# EAGLE design BeagleboneCape-V2 (EAGLE 6.4)
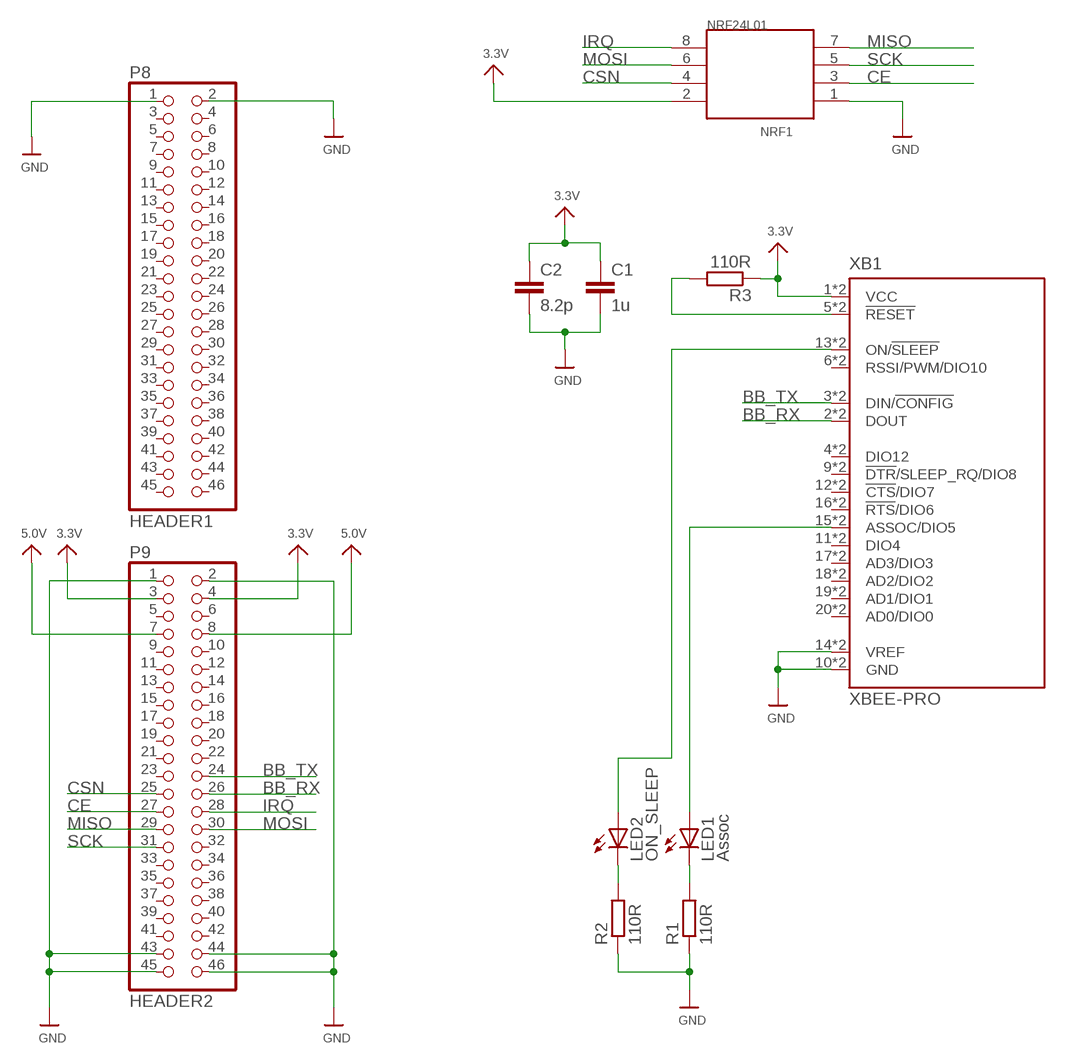
[diagram p0: schematic, sheet 1]

## Parts
C1  1u  C-EUC1206  [C1206]
C2  8.2p  C-EUC1206  [C1206]
LED1  Assoc  LEDSMT1206  [1206]
LED2  ON_SLEEP  LEDSMT1206  [1206]
NRF24L01  NRF1  2X4SMDHEADER  [TSM-110-XX-XXX-DV]
P8  HEADER1  PINHD-2X24  [2X23]
P9  HEADER2  PINHD-2X24  [2X23]
R1  110R  R-EU_R1206  [R1206]
R2  110R  R-EU_R1206  [R1206]
R3  110R  R-EU_R1206  [R1206]
XB1  XBEE-PRO  [XBEE-PRO]

## Nets
3.3V: C1.1 C2.1 NRF24L01.2 P9.3 P9.4 R3.1 XB1.1(VCC) XB1.1-1(VCC)
5.0V: P9.7 P9.8
ASSOC: LED1.A XB1.15(ASSOC/DIO5) XB1.15-1(ASSOC/DIO5)
BB_RX: P9.26 XB1.2(DOUT) XB1.2-1(DOUT)
BB_TX: P9.24 XB1.3(DIN/!CONFIG) XB1.3-1(DIN/!CONFIG)
CE: NRF24L01.3 P9.27
CSN: NRF24L01.4 P9.25
GND: C1.2 C2.2 NRF24L01.1 P8.1 P8.2 P9.1 P9.2 P9.43 P9.44 P9.45 P9.46 R1.1 R2.1 XB1.10(GND) XB1.10-1(GND) XB1.14(VREF) XB1.14-1(VREF)
IRQ: NRF24L01.8 P9.28
MISO: NRF24L01.7 P9.29
MOSI: NRF24L01.6 P9.30
N$1: LED1.C R1.2
N$2: R3.2 XB1.5(!RESET) XB1.5-1(!RESET)
N$3: LED2.C R2.2
ON_SLEEP: LED2.A XB1.13(ON/!SLEEP) XB1.13-1(ON/!SLEEP)
SCK: NRF24L01.5 P9.31
Unconnected: P8.3 P8.4 P8.5 P8.6 P8.7 P8.8 P8.9 P8.10 P8.11 P8.12 P8.13 P8.14 P8.15 P8.16 P8.17 P8.18 P8.19 P8.20 P8.21 P8.22 P8.23 P8.24 P8.25 P8.26 P8.27 P8.28 P8.29 P8.30 P8.31 P8.32 P8.33 P8.34 P8.35 P8.36 P8.37 P8.38 P8.39 P8.40 P8.41 P8.42 P8.43 P8.44 P8.45 P8.46 P9.5 P9.6 P9.9 P9.10 P9.11 P9.12 P9.13 P9.14 P9.15 P9.16 P9.17 P9.18 P9.19 P9.20 P9.21 P9.22 P9.23 P9.32 P9.33 P9.34 P9.35 P9.36 P9.37 P9.38 P9.39 P9.40 P9.41 P9.42 XB1.4(DIO12) XB1.4-1(DIO12) XB1.6(RSSI/PWM/DIO10) XB1.6-1(RSSI/PWM/DIO10) XB1.9(!DTR!/SLEEP_RQ/DIO8) XB1.9-1(!DTR!/SLEEP_RQ/DIO8) XB1.11(DIO4) XB1.11-1(DIO4) XB1.12(!CTS!/DIO7) XB1.12-1(!CTS!/DIO7) XB1.16(!RTS!/DIO6) XB1.16-1(!RTS!/DIO6) XB1.17(AD3/DIO3) XB1.17-1(AD3/DIO3) XB1.18(AD2/DIO2) XB1.18-1(AD2/DIO2) XB1.19(AD1/DIO1) XB1.19-1(AD1/DIO1) XB1.20(AD0/DIO0) XB1.20-1(AD0/DIO0)

## Library data of the parts
C1 C2 = rcl:C-EU: CAPACITOR, European symbol
LED1 LED2 = led:LED: LED OSRAM: - CHIPLED LG R971, LG N971, LY N971, LG Q971, LY Q971, LO R971, LY R971 LH N974, LH R974 LS Q976, LO Q976, LY Q976 LO Q996 - Hyper CHIPLED LW Q18S LB Q993, LB Q99A, LB R99A - SideLED LS A670, LO A670, LY A670, LG A670, LP A670 LB A673, LV A673, LT A673, LW A673 LH A674 LY A675 LS A676, LA A676, LO A676, LY A676, LW A676 LS A679, LY A679, LG A679 - Hyper Micro SIDELED® LS Y876, LA Y876, LO Y876, LY Y876 LT Y87S - SmartLED LW L88C, LW L88S LB L89C, LB L89S, LG L890 LS L89K, LO L89K, LY L89K LS L896, LA L896, LO L896, LY L896 - TOPLED LS T670, LO T670, LY T670, LG T670, LP T670 LSG T670, LSP T670, LSY T670, LOP T670, LYG T670 LG T671, LOG T671, LSG T671 LB T673, LV T673, LT T673, LW T673 LH T674 LS T676, LA T676, LO T676, LY T676, LB T676, LH T676, LSB T676, LW T676 LB T67C, LV T67C, LT T67C, LS T67K, LO T67K, LY T67K, LW E67C LS E67B, LA E67B, LO E67B, LY E67B, LB E67C, LV E67C, LT E67C LW T67C LS T679, LY T679, LG T679 LS T770, LO T770, LY T770, LG T770, LP T770 LB T773, LV T773, LT T773, LW T773 LH T774 LS E675, LA E675, LY E675, LS T675 LS T776, LA T776, LO T776, LY T776, LB T776 LHGB T686 LT T68C, LB T68C - Hyper Mini TOPLED® LB M676 - Mini TOPLED Santana® LG M470 LS M47K, LO M47K, LY M47K Source: http://www.osram.convergy.de LUXEON: - LUMILED® LXK2-PW12-R00, LXK2-PW12-S00, LXK2-PW14-U00, LXK2-PW14-V00 LXK2-PM12-R00, LXK2-PM12-S00, LXK2-PM14-U00 LXK2-PE12-Q00, LXK2-PE12-R00, LXK2-PE12-S00, LXK2-PE14-T00, LXK2-PE14-U00 LXK2-PB12-K00, LXK2-PB12-L00, LXK2-PB12-M00, LXK2-PB14-N00, LXK2-PB14-P00, LXK2-PB14-Q00 LXK2-PR12-L00, LXK2-PR12-M00, LXK2-PR14-Q00, LXK2-PR14-R00 LXK2-PD12-Q00, LXK2-PD12-R00, LXK2-PD12-S00 LXK2-PH12-R00, LXK2-PH12-S00 LXK2-PL12-P00, LXK2-PL12-Q00, LXK2-PL12-R00 Source: www.luxeon.com KINGBRIGHT: KA-3528ASYC Source: www.kingbright.com
NRF24L01 = Header:2X4SMDHEADER
P8 P9 = 2X23Header:PINHD-2X24: PIN HEADER
R1-R3 = rcl:R-EU_: RESISTOR, European symbol
XB1 = xbee:XBEE: XBee (TM) /XBee-PRO(TM) OEM RF Modules Source: MaxStream, Inc. xbee_productmanual.pdf; MPN: XBP24-AWI-001; OC_FARNELL: 1337916; OC_NEWARK: 42M2667

## Board
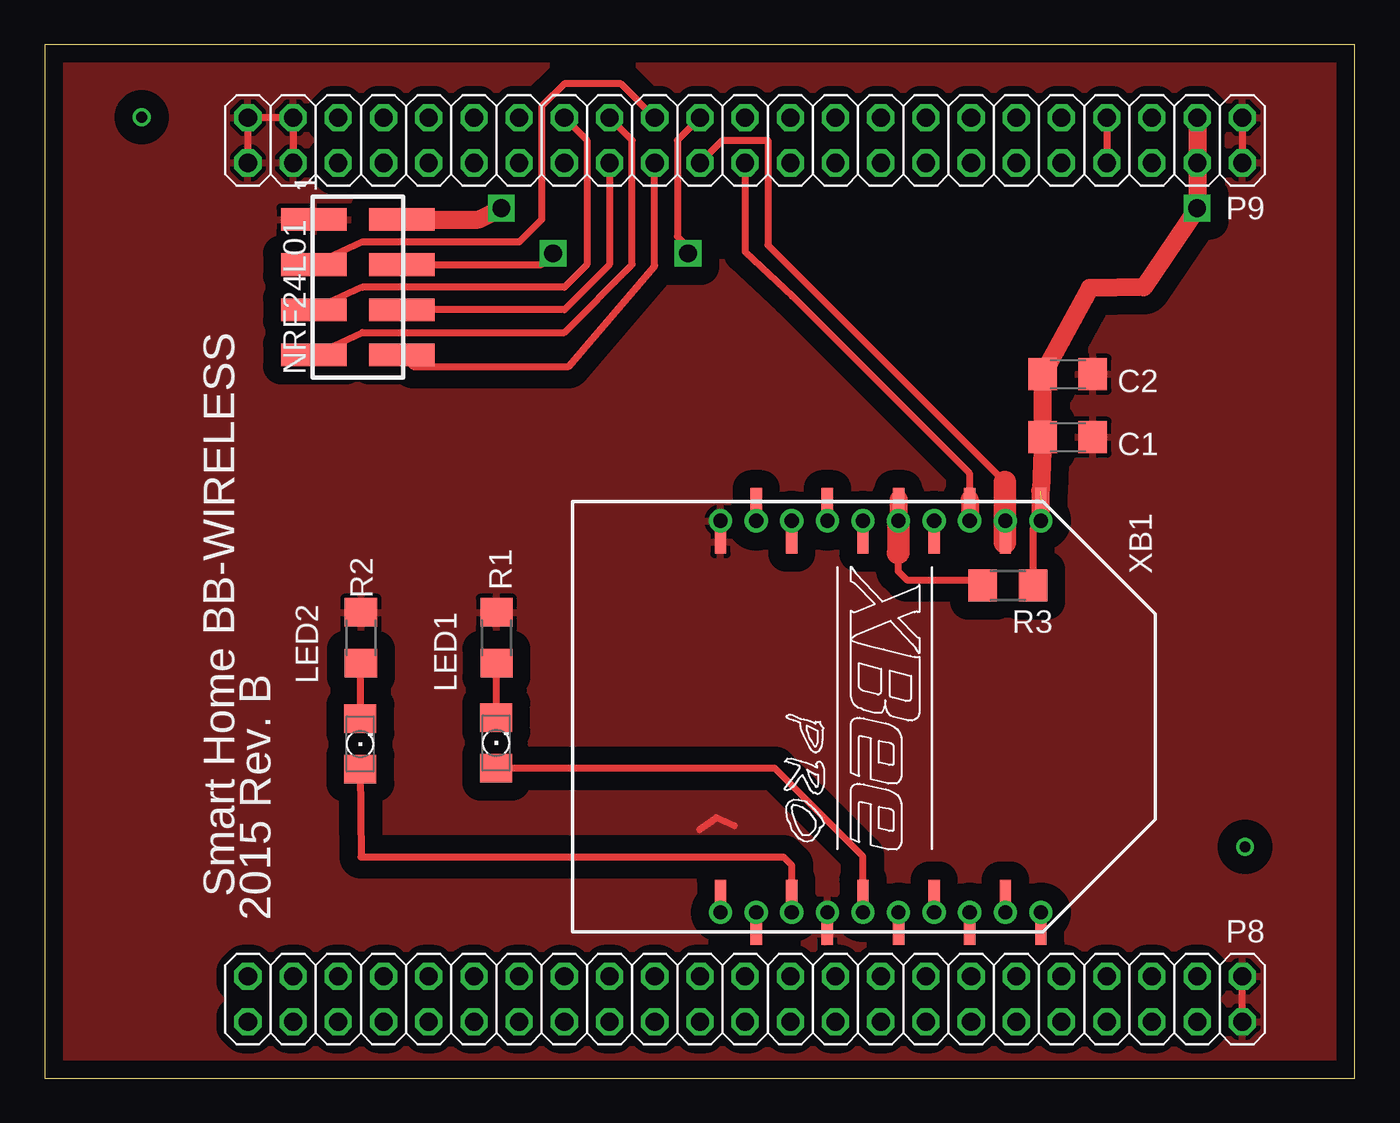
[diagram p1: board, top side]
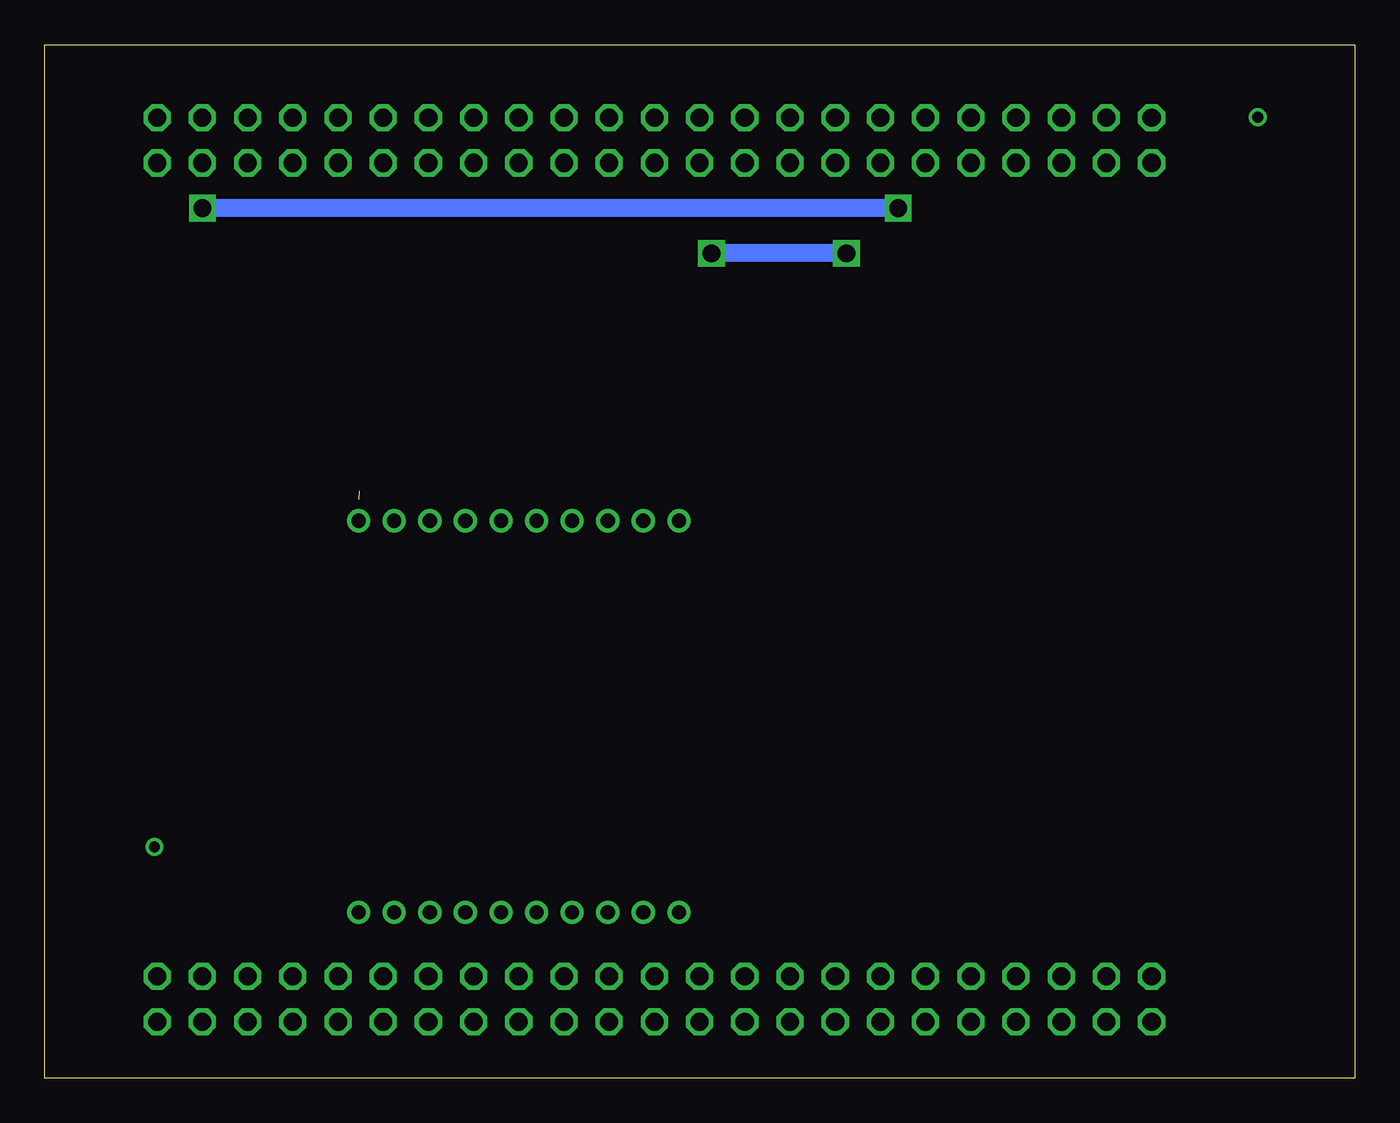
[diagram p2: board, bottom side, seen from below]

Size 73.64 x 58.09 mm. Coordinates in mm from the lower left corner, seen from the top.
Outline: 0,0 73.64,0 73.64,58.09 0,58.09 0,0
Copper layers (1*16): Top 0.035mm / dielectric 1.5mm / Bottom 0.035mm
Design rules "default": minimum track width 10mil, minimum drill 24mil, track to track 8mil, track to pad 8mil, pad to pad 8mil, via to via 8mil, smd to smd 8mil, copper to edge 40mil, drill to drill 8mil, minimum pad ring 10mil, minimum via ring 8mil, stop-mask expansion 4mil, vias tented up to drill 0mil, thermal gap 10mil

### Footprints (pad centres in the part's own frame; a part is rotated, then mirrored left to right if it is on the bottom)
C1206 = smd 1.6 x 1.8: 1 -1.4,0; 2 1.4,0
1206 = smd 1.6 x 1.803: A -1.422,0; C 1.422,0
TSM-110-XX-XXX-DV = smd 1.27 x 3.683: 1 -3.81,-2.731; 2 -3.81,2.223; 3 -1.27,-2.731; 4 -1.27,2.223; 5 1.27,-2.731; 6 1.27,2.223; 7 3.81,-2.731; 8 3.81,2.223
2X23 = drill 1.016 octagon: 1 -27.94,-1.27; 2 -27.94,1.27; 3 -25.4,-1.27; 4 -25.4,1.27; 5 -22.86,-1.27; 6 -22.86,1.27; 7 -20.32,-1.27; 8 -20.32,1.27; 9 -17.78,-1.27; 10 -17.78,1.27; 11 -15.24,-1.27; 12 -15.24,1.27; 13 -12.7,-1.27; 14 -12.7,1.27; 15 -10.16,-1.27; 16 -10.16,1.27; 17 -7.62,-1.27; 18 -7.62,1.27; 19 -5.08,-1.27; 20 -5.08,1.27; 21 -2.54,-1.27; 22 -2.54,1.27; 23 0,-1.27; 24 0,1.27; 25 2.54,-1.27; 26 2.54,1.27; 27 5.08,-1.27; 28 5.08,1.27; 29 7.62,-1.27; 30 7.62,1.27; 31 10.16,-1.27; 32 10.16,1.27; 33 12.7,-1.27; 34 12.7,1.27; 35 15.24,-1.27; 36 15.24,1.27; 37 17.78,-1.27; 38 17.78,1.27; 39 20.32,-1.27; 40 20.32,1.27; 41 22.86,-1.27; 42 22.86,1.27; 43 25.4,-1.27; 44 25.4,1.27; 45 27.94,-1.27; 46 27.94,1.27
R1206 = smd 1.6 x 1.803: 1 -1.422,0; 2 1.422,0
XBEE-PRO = drill 0.8 pad 1.27: 1 -11,9; 2 -11,7; 3 -11,5; 4 -11,3; 5 -11,1; 6 -11,-1; 7 -11,-3; 8 -11,-5; 9 -11,-7; 10 -11,-9; 11 11,-9; 12 11,-7; 13 11,-5; 14 11,-3; 15 11,-1; 16 11,1; 17 11,3; 18 11,5; 19 11,7; 20 11,9 | smd 1.27 x 0.635: 1-1 -12.2,9; 2-1 -9.8,7; 3-1 -12.2,5; 4-1 -9.8,3; 5-1 -12.2,1; 6-1 -9.8,-1; 7-1 -12.2,-3; 8-1 -9.8,-5; 9-1 -12.2,-7; 10-1 -9.8,-9; 11-1 9.8,-9; 12-1 12.2,-7; 13-1 9.8,-5; 14-1 12.2,-3; 15-1 9.8,-1; 16-1 12.2,1; 17-1 9.8,3; 18-1 12.2,5; 19-1 9.8,7; 20-1 12.2,9

### Placement (x,y rotation side)
C1  57.5,36.02 0 top
C2  57.5,39.56 0 top
LED1  25.38,18.84 90 top
LED2  17.74,18.78 90 top
NRF24L01  17.86,44.45 270 top
P8  39.37,4.45 180 top
P9  39.37,52.7 180 top
R1  25.4,24.75 270 top
R2  17.78,24.75 270 top
R3  54.13,27.69 180 top
XB1  46.99,20.32 270 top

### Tracks (layer width: path | path; a pad name or v marks a point on that pad's centre or on a via)
3.3V  (via drill 1)  (1 unrouted)
  Top 0.406: XB1.1 55.55,30.88 R3.1
  Top 1.016: P9.3 P9.4 v64.77,48.9 61.77,44.45 58.73,44.41 C2.1 C1.1 55.98,33.02 55.96,33 55.96,31.35 XB1.1 | NRF24L01.2 24.4,48.26 v25.67,48.9
  Bottom 1.016: v25.67,48.9 v64.77,48.9
5.0V
  Top 0.406: P9.7 P9.8
ASSOC
  Top 0.406: XB1.15 XB1.15-1 45.96,10.55 45.96,12.5 41.04,17.42 LED1.A
BB_RX
  Top 0.406: P9.26 38.1,52.7 40.64,52.7 40.64,46.82 53.96,33.5 | 53.96,31.35 XB1.2 XB1.2-1 53.96,30.09 53.96,30
  Top 1.27: 53.96,33.5 53.96,30.09
BB_TX
  Top 0.406: 39.24,51.44 P9.24 39.37,46.44 42.02,43.94 51.96,34 51.96,32.55 XB1.3-1
  Top 1.016: XB1.3-1 XB1.3
CE
  Top 0.406: P9.27 32.38,55.88 29.21,55.88 27.94,54.61 27.94,48.26 26.67,46.99 17.86,46.99 NRF24L01.3
CSN  (via drill 1)
  Top 0.406: P9.25 35.56,52.7 35.56,47.3 36.16,46.7 v36.16,46.35 | NRF24L01.4 27.94,45.72 v28.57,46.35
  Bottom 1.016: v28.57,46.35 v36.16,46.35
GND
  Top 0.406: P9.1 P9.2 | P9.46 P9.45 P9.43 P9.44 | P8.2 P8.1 | XB1.14 43.99,9.35 | 38.76,14.18 37.76,14.64 36.83,13.97
  pour Top (isolate 1.016): 0,0 0,58.42 72.39,58.42 72.39,0
IRQ
  Top 0.406: NRF24L01.8 20.72,40 29.46,40 34.26,45.6 34.29,45.67 P9.28
MISO
  Top 0.406: NRF24L01.7 17.86,41.91 29.21,41.91 33.02,45.72 33.02,52.7 P9.29
MOSI
  Top 0.406: P9.30 31.75,45.72 29.21,43.18 NRF24L01.6
N$1
  Top 0.406: R1.2 25.38,23.33 LED1.C
N$2
  Top 0.406: 47.96,29.5 47.96,28.5 48.46,28 52.46,28 R3.2
  Top 1.016: XB1.5-1 XB1.5
  Top 1.27: XB1.5 47.99,29.53 47.96,29.5
N$3
  Top 0.406: R2.2 17.74,23.33 LED2.C
N$4  (via drill 0.6)
  other vias: 5.46,54 67.46,13
ON_SLEEP
  Top 0.406: LED2.A 17.78,12.43 41.53,12.43 41.96,12 41.96,9.35 XB1.13 XB1.13-1
SCK
  Top 0.406: P9.31 30.48,52.7 30.48,45.72 29.21,44.45 17.86,44.45 NRF24L01.5

### Text on the board
_tNames: Smart Home BB-WIRELESS | 2015 Rev. B